# Altium schematic sheet Top.SchDoc
size A; SheetNumber: 2; SheetTotal: 4
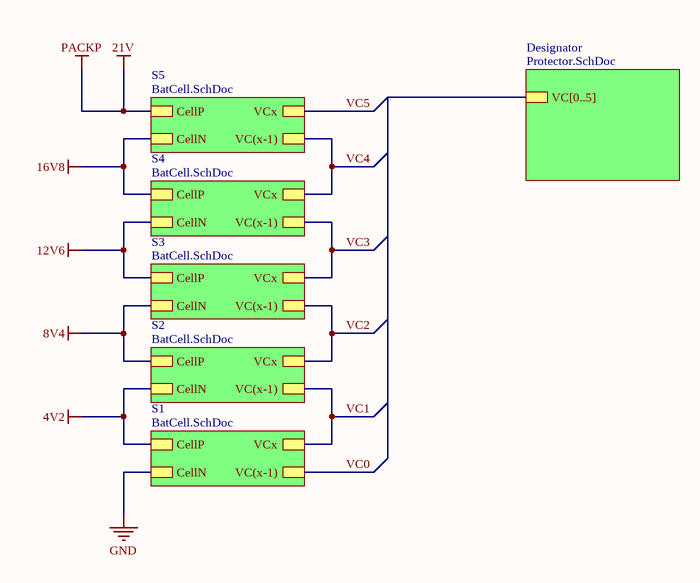
[diagram p0: Top.SchDoc]

## Sub-sheets
Designator = Protector.SchDoc: VC[0..5]
S1 = BatCell.SchDoc: VCx, VC(x-1), CellP, CellN
S2 = BatCell.SchDoc: VCx, VC(x-1), CellP, CellN
S3 = BatCell.SchDoc: VCx, VC(x-1), CellP, CellN
S4 = BatCell.SchDoc: VCx, VC(x-1), CellP, CellN
S5 = BatCell.SchDoc: VCx, VC(x-1), CellP, CellN

## Nets
4V2: sheet S2/CellN, sheet S1/CellP
8V4: sheet S3/CellN, sheet S2/CellP
12V6: sheet S4/CellN, sheet S3/CellP
16V8: sheet S5/CellN, sheet S4/CellP
21V: sheet S5/CellP  [also labelled PACKP]
GND: sheet S1/CellN
VC0: sheet S1/VC(x-1)
VC1: sheet S2/VC(x-1), sheet S1/VCx
VC2: sheet S3/VC(x-1), sheet S2/VCx
VC3: sheet S4/VC(x-1), sheet S3/VCx
VC4: sheet S5/VC(x-1), sheet S4/VCx
VC5: sheet S5/VCx